# EAGLE design sensor (EAGLE 7.5.0)
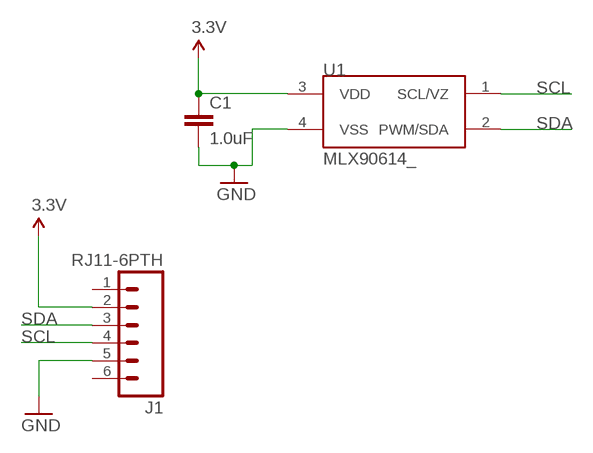
[diagram p0: schematic, sheet 1]

## Parts
C1  1.0uF  1.0UF-25V-+80/-20(0805)  [0805]
J1  RJ11-6PTH  [RJ11-6]
U1  MLX90614_  [TO-39]

## Nets
3.3V: C1.1 J1.2 U1.3(VDD)
GND: C1.2 J1.5 U1.4(VSS)
SCL: J1.4 U1.1(SCL/VZ)
SDA: J1.3 U1.2(PWM/SDA)
Unconnected: J1.1 J1.6

## Library data of the parts
C1 = SparkFun-Capacitors:1.0UF-25V-+80/-20(0805): CAP-11625; PROD_ID: CAP-11625
J1 = synfinatic:RJ11-6: RJ11 Jack Simple 6 pin RJ11 jack. Commonly found on CAT3 devices and Microchip programmers. SKU: PRT-00132 AKA: Assmann WSW Components A-2004-0-4-LP-N-R http://www.digikey.com/scripts/DkSearch/dksus.dll?Detail&itemSeq=188493072&uq=635893574606648195
U1 = SparkFun-Sensors:MLX90614: Non-contact PIR I2C interface temperature sensor

## Board
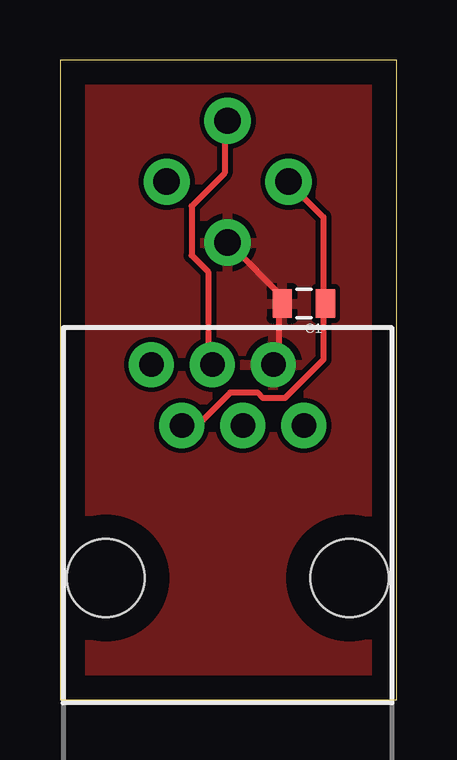
[diagram p1: board, top side]
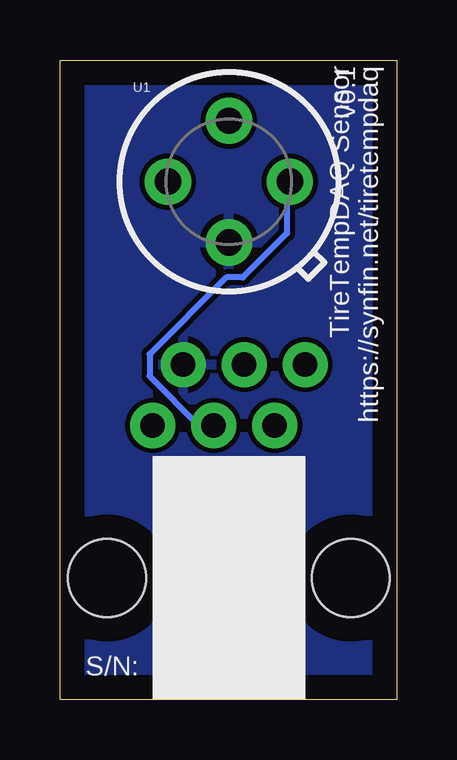
[diagram p2: board, bottom side, seen from below]

Size 14.02 x 26.66 mm. Coordinates in mm from the lower left corner, seen from the top.
Outline: 0,0 14.02,0 14.02,26.66 0,26.66 0,0
Copper layers (1*16): Top 0.035mm / dielectric 1.5mm / Bottom 0.035mm
Design rules "default": minimum track width 10mil, minimum drill 24mil, track to track 8mil, track to pad 8mil, pad to pad 8mil, via to via 8mil, smd to smd 8mil, copper to edge 40mil, drill to drill 8mil, minimum pad ring 10mil, minimum via ring 8mil, stop-mask expansion 4mil, vias tented up to drill 0mil, thermal gap 10mil

### Footprints (pad centres in the part's own frame; a part is rotated, then mirrored left to right if it is on the bottom)
0805 = smd 0.8 x 1.2: 1 -0.9,0; 2 0.9,0
RJ11-6 = drill 1.016 pad 1.88: 1 1.905,8.89; 2 3.175,6.35; 3 4.445,8.89; 4 5.715,6.35; 5 6.985,8.89; 6 8.255,6.35 | hole 3.251: 0,0; 10.16,0
TO-39 = drill 1.1 pad 1.93: 1 2.54,0; 2 0,2.54; 3 -2.54,0; 4 0,-2.54

### Placement (x,y rotation side)
C1  10.16,16.51 180 top
J1  1.91,5.08 0 top
U1  6.99,21.59 0 bottom

### Tracks (layer width: path | path; a pad name or v marks a point on that pad's centre or on a via)
3.3V
  Top 0.254: U1.3 9.6,21.49 10.97,20.12 10.97,16.69 C1.1 10.97,16.46 10.97,14.17 9.37,12.57 8.46,12.57 8.23,12.8 7.09,12.8 5.71,11.43 J1.2
GND
  Top 0.254: J1.5 8.91,14.17 9.14,14.4 9.14,16.46 C1.2 9.37,16.69 7.09,18.97 U1.4
  pour Bottom: 0.25,26.42 13.72,26.42 13.72,0.25 0.25,0.25
  pour Top: 0.51,26.16 13.72,26.16 13.72,0.25 0.51,0.25
SCL
  Bottom 0.254: J1.4 8.23,11.43 10.29,13.49 10.29,14.4 7.09,17.6 6.4,17.6 4.57,19.43 4.57,21.49 U1.1
SDA
  Top 0.254: J1.3 6.17,14.17 6.17,17.83 5.49,18.52 5.49,20.57 6.86,21.95 6.86,24 U1.2

### Text on the board
bNames: v0.1 | TireTempDAQ Sensor / https://synfin.net/tiretempdaq | S/N: